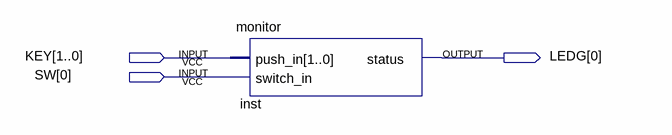
[diagram p0: schematic sheet]
// Quartus schematic monitor_tb.bdf as structural Verilog: 1 symbols, 3 pins
module monitor_tb (
  input  [1:0] KEY,
  input  [0:0] SW,
  output [0:0] LEDG
);

  monitor inst (.push_in(KEY), .switch_in(SW[0]), .status(LEDG[0]));
endmodule
